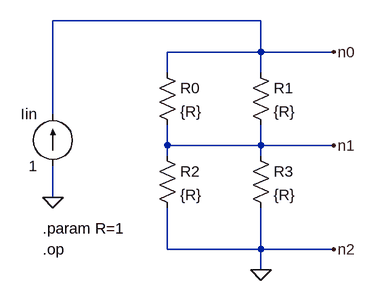
[diagram p0: schematic ResistorNetwork_1.asc]
ResistorNetwork_1.asc, the LTspice schematic file:
Version 4
SHEET 1 880 680
WIRE 288 48 -32 48
WIRE 288 96 288 48
WIRE 288 96 144 96
WIRE 400 96 288 96
WIRE 144 128 144 96
WIRE 288 128 288 96
WIRE -32 192 -32 48
WIRE 144 240 144 208
WIRE 288 240 288 208
WIRE 288 240 144 240
WIRE 400 240 288 240
WIRE 144 256 144 240
WIRE 288 256 288 240
WIRE -32 320 -32 272
WIRE 144 400 144 336
WIRE 288 400 288 336
WIRE 288 400 144 400
WIRE 400 400 288 400
WIRE 288 432 288 400
FLAG -32 320 0
FLAG 288 432 0
FLAG 400 240 n1
FLAG 400 96 n0
FLAG 400 400 n2
SYMBOL res 272 112 R0
SYMATTR InstName R1
SYMATTR Value {R}
SYMBOL res 128 240 R0
SYMATTR InstName R2
SYMATTR Value {R}
SYMBOL res 272 240 R0
SYMATTR InstName R3
SYMATTR Value {R}
SYMBOL res 128 112 R0
SYMATTR InstName R0
SYMATTR Value {R}
SYMBOL current -32 272 R180
WINDOW 0 24 80 Left 2
WINDOW 3 24 0 Left 2
WINDOW 123 0 0 Left 0
WINDOW 39 0 0 Left 0
SYMATTR InstName Iin
SYMATTR Value 1
TEXT -48 400 Left 2 !.op
TEXT -48 368 Left 2 !.param R=1

The netlist it stands for:
* ResistorNetwork_1.asc
R1 n0 n1 {R}
R2 n1 0 {R}
R3 n1 0 {R}
R0 n0 n1 {R}
Iin 0 n0 1
.op
.param R=1
.backanno
.end